# Altium schematic sheet Peripherals.SchDoc
size 420 x 297 mm; SheetNumber: 6; SheetTotal: 11; SPICEModelCacheINPTFRLM: <root> / <DocumentId>INPTFRLM</DocumentId> / <CacheFrame Number="0"> / <Model Name="0603_885012206095_100nf" Kind="CKT"> / <Text>******* / .subckt 0603_885012206095_100nF 1 2 / Rser 1 3 0.0157659152881 / Lser 2 4 3.10171966E-10 / C1 3 4 0.0000001 / Rpar 3 4 5000000000 / .ends 0603_885012206095_100nF</Text> / </Model> / <Model Name="0603_885012106006_10uf" Kind="CKT"> / <Text>******* / .subckt 0603_885012106006_10uF 1 2 / Rser 1 3 0.00407641026021 / Lser 2 4 4.16060333E-10 / C1 3 4 0.00001 / Rpar 3 4 5000000 / .ends 0603_885012106006_10uF</Text> / </Model> / </CacheFrame> / </root>
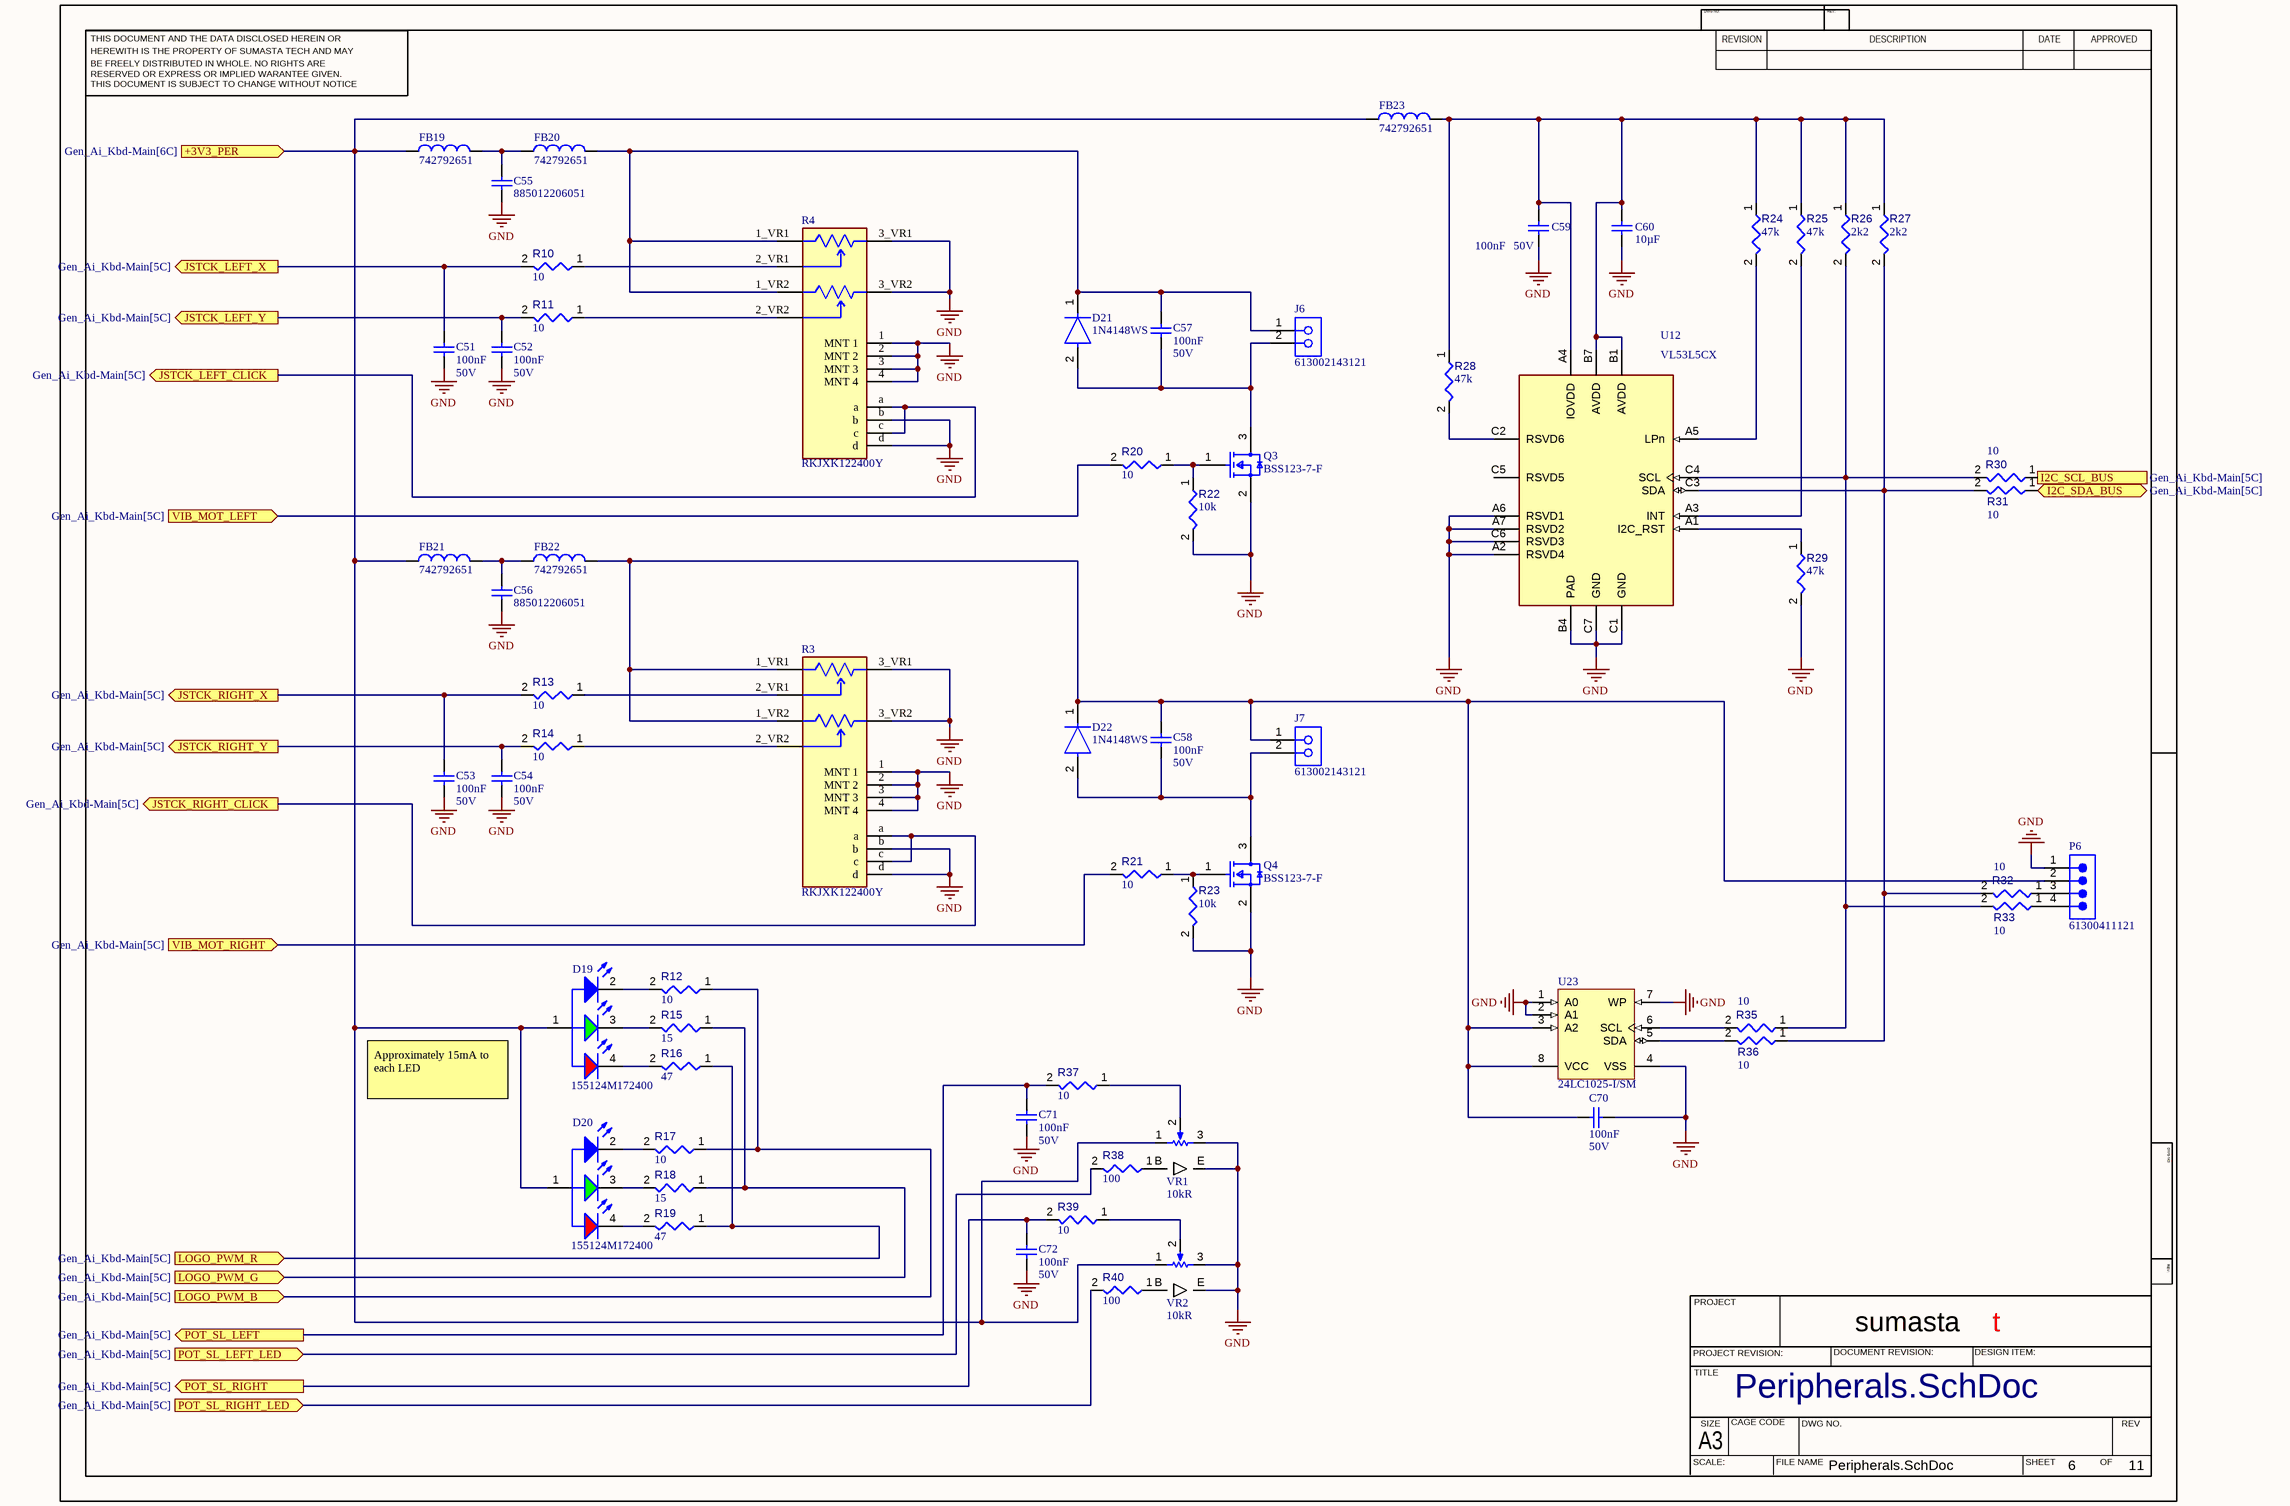
[diagram p0: Peripherals.SchDoc]

## Parts
C51  Capacitance: 100nF  Rated Voltage (DC): 50V  [WCAP-CSGP_0603_L1.6W0.8H0.8_Reflow]  (hidden comment: 885012206095)
C52  Capacitance: 100nF  Rated Voltage (DC): 50V  [WCAP-CSGP_0603_L1.6W0.8H0.8_Reflow]  (hidden comment: 885012206095)
C53  Capacitance: 100nF  Rated Voltage (DC): 50V  [WCAP-CSGP_0603_L1.6W0.8H0.8_Reflow]  (hidden comment: 885012206095)
C54  Capacitance: 100nF  Rated Voltage (DC): 50V  [WCAP-CSGP_0603_L1.6W0.8H0.8_Reflow]  (hidden comment: 885012206095)
C55  885012206051  [WCAP-CSGP_0603_L1.6W0.8H0.8_Reflow]
C56  885012206051  [WCAP-CSGP_0603_L1.6W0.8H0.8_Reflow]
C57  Capacitance: 100nF  Rated Voltage (DC): 50V  [WCAP-CSGP_0603_L1.6W0.8H0.8_Reflow]  (hidden comment: 885012206095)
C58  Capacitance: 100nF  Rated Voltage (DC): 50V  [WCAP-CSGP_0603_L1.6W0.8H0.8_Reflow]  (hidden comment: 885012206095)
C59  Capacitance: 100nF  Rated Voltage (DC): 50V  [WCAP-CSGP_0603_L1.6W0.8H0.8_Reflow]  (hidden comment: 885012206095)
C60  Capacitance: 10µF  [WCAP-CSGP_0603_L1.6W0.8H0.8_Reflow]  (hidden comment: 885012106006)
C70  Capacitance: 100nF  Rated Voltage (DC): 50V  [WCAP-CSGP_0603_L1.6W0.8H0.8_Reflow]  (hidden comment: 885012206095)
C71  Capacitance: 100nF  Rated Voltage (DC): 50V  [WCAP-CSGP_0603_L1.6W0.8H0.8_Reflow]  (hidden comment: 885012206095)
C72  Capacitance: 100nF  Rated Voltage (DC): 50V  [WCAP-CSGP_0603_L1.6W0.8H0.8_Reflow]  (hidden comment: 885012206095)
D19  155124M172400  [WL-SFSW_1204_155124M172400]
D20  155124M172400  [WL-SFSW_1204_155124M172400]
D21  1N4148WS  [FP-477AB-IPC_C]
D22  1N4148WS  [FP-477AB-IPC_C]
FB19  742792651  [WE-CBF_0603_L1.6W0.8H0.8_HC]
FB20  742792651  [WE-CBF_0603_L1.6W0.8H0.8_HC]
FB21  742792651  [WE-CBF_0603_L1.6W0.8H0.8_HC]
FB22  742792651  [WE-CBF_0603_L1.6W0.8H0.8_HC]
FB23  742792651  [WE-CBF_0603_L1.6W0.8H0.8_HC]
J6  613002143121  [613002143121]
J7  613002143121  [613002143121]
P6  61300411121  [61300411121]
Q3  BSS123-7-F  [FP-SOT23-MFG]
Q4  BSS123-7-F  [FP-SOT23-MFG]
R3  RKJXK122400Y  [FP-RKJXK122400Y-MFG]
R4  RKJXK122400Y  [FP-RKJXK122400Y-MFG]
R10  value 10  [RESC1608X55X25ML10T15]  (hidden comment: Resistor 10k +/-1% 0603 100 mW)
R11  value 10  [RESC1608X55X25ML10T15]  (hidden comment: Resistor 10k +/-1% 0603 100 mW)
R12  value 10  [RESC1608X55X25ML10T15]  (hidden comment: Resistor 10k +/-1% 0603 100 mW)
R13  value 10  [RESC1608X55X25ML10T15]  (hidden comment: Resistor 10k +/-1% 0603 100 mW)
R14  value 10  [RESC1608X55X25ML10T15]  (hidden comment: Resistor 10k +/-1% 0603 100 mW)
R15  value 15  [RESC1608X55X25ML10T15]  (hidden comment: Resistor 10k +/-1% 0603 100 mW)
R16  value 47  [RESC1608X55X25ML10T15]  (hidden comment: Resistor 10k +/-1% 0603 100 mW)
R17  value 10  [RESC1608X55X25ML10T15]  (hidden comment: Resistor 10k +/-1% 0603 100 mW)
R18  value 15  [RESC1608X55X25ML10T15]  (hidden comment: Resistor 10k +/-1% 0603 100 mW)
R19  value 47  [RESC1608X55X25ML10T15]  (hidden comment: Resistor 10k +/-1% 0603 100 mW)
R20  value 10  [RESC1608X55X25ML10T15]  (hidden comment: Resistor 10k +/-1% 0603 100 mW)
R21  value 10  [RESC1608X55X25ML10T15]  (hidden comment: Resistor 10k +/-1% 0603 100 mW)
R22  value 10k  [RESC1608X55X25ML10T15]  (hidden comment: Resistor 10k +/-1% 0603 100 mW)
R23  value 10k  [RESC1608X55X25ML10T15]  (hidden comment: Resistor 10k +/-1% 0603 100 mW)
R24  value 47k  [RESC1608X55X25ML10T15]  (hidden comment: Resistor 10k +/-1% 0603 100 mW)
R25  value 47k  [RESC1608X55X25ML10T15]  (hidden comment: Resistor 10k +/-1% 0603 100 mW)
R26  value 2k2  [RESC1608X55X25ML10T15]  (hidden comment: Resistor 10k +/-1% 0603 100 mW)
R27  value 2k2  [RESC1608X55X25ML10T15]  (hidden comment: Resistor 10k +/-1% 0603 100 mW)
R28  value 47k  [RESC1608X55X25ML10T15]  (hidden comment: Resistor 10k +/-1% 0603 100 mW)
R29  value 47k  [RESC1608X55X25ML10T15]  (hidden comment: Resistor 10k +/-1% 0603 100 mW)
R30  value 10  [RESC1608X55X25ML10T15]  (hidden comment: Resistor 10k +/-1% 0603 100 mW)
R31  value 10  [RESC1608X55X25ML10T15]  (hidden comment: Resistor 10k +/-1% 0603 100 mW)
R32  value 10  [RESC1608X55X25ML10T15]  (hidden comment: Resistor 10k +/-1% 0603 100 mW)
R33  value 10  [RESC1608X55X25ML10T15]  (hidden comment: Resistor 10k +/-1% 0603 100 mW)
R35  value 10  [RESC1608X55X25ML10T15]  (hidden comment: Resistor 10k +/-1% 0603 100 mW)
R36  value 10  [RESC1608X55X25ML10T15]  (hidden comment: Resistor 10k +/-1% 0603 100 mW)
R37  value 10  [RESC1608X55X25ML10T15]  (hidden comment: Resistor 10k +/-1% 0603 100 mW)
R38  value 100  [RESC1608X55X25ML10T15]  (hidden comment: Resistor 10k +/-1% 0603 100 mW)
R39  value 10  [RESC1608X55X25ML10T15]  (hidden comment: Resistor 10k +/-1% 0603 100 mW)
R40  value 100  [RESC1608X55X25ML10T15]  (hidden comment: Resistor 10k +/-1% 0603 100 mW)
U12  VL53L5CX  [VL53L5CX]
U23  24LC1025-I/SM  [SOIJ-SM8_L]
VR1  value 10kR  [PTL30-15R0]  (hidden comment: PTL30-15R0-103B1)
VR2  value 10kR  [PTL30-15R0]  (hidden comment: PTL30-15R0-103B1)

## Ports
+3V3_PER (in, see Gen_Ai_Kbd-Main[6C]), I2C_SCL_BUS (in, see Gen_Ai_Kbd-Main[5C]), I2C_SDA_BUS (bidir, see Gen_Ai_Kbd-Main[5C]), JSTCK_LEFT_CLICK (out, see Gen_Ai_Kbd-Main[5C]), JSTCK_LEFT_X (out, see Gen_Ai_Kbd-Main[5C]), JSTCK_LEFT_Y (out, see Gen_Ai_Kbd-Main[5C]), JSTCK_RIGHT_CLICK (out, see Gen_Ai_Kbd-Main[5C]), JSTCK_RIGHT_X (out, see Gen_Ai_Kbd-Main[5C]), JSTCK_RIGHT_Y (out, see Gen_Ai_Kbd-Main[5C]), LOGO_PWM_B (in, see Gen_Ai_Kbd-Main[5C]), LOGO_PWM_G (in, see Gen_Ai_Kbd-Main[5C]), LOGO_PWM_R (in, see Gen_Ai_Kbd-Main[5C]), POT_SL_LEFT (out, see Gen_Ai_Kbd-Main[5C]), POT_SL_LEFT_LED (in, see Gen_Ai_Kbd-Main[5C]), POT_SL_RIGHT (out, see Gen_Ai_Kbd-Main[5C]), POT_SL_RIGHT_LED (in, see Gen_Ai_Kbd-Main[5C]), VIB_MOT_LEFT (in, see Gen_Ai_Kbd-Main[5C]), VIB_MOT_RIGHT (in, see Gen_Ai_Kbd-Main[5C])

## Nets
GND: C51.2 C52.2 C53.2 C54.2 C55.1 C56.1 C59.1 C60.1 C70.1 C71.2 C72.2 P6.1 Q3.2(S) Q4.2(S) R3.1(MNT_1) R3.2(MNT_2) R3.3(MNT_3) R3.3_VR1(3_VR1) R3.3_VR2(3_VR2) R3.4(MNT_4) R3.b R3.d R4.1(MNT_1) R4.2(MNT_2) R4.3(MNT_3) R4.3_VR1(3_VR1) R4.3_VR2(3_VR2) R4.4(MNT_4) R4.b R4.d R22.2 R23.2 R29.2 U12.A2(RSVD4) U12.A6(RSVD1) U12.A7(RSVD2) U12.B4(PAD) U12.C1(GND) U12.C6(RSVD3) U12.C7(GND) U23.1(A0) U23.2(A1) U23.4(VSS) U23.7(WP) VR1.3(CCW) VR1.E(CCW) VR2.3(CCW) VR2.E(CCW)
+3V3_PER: D19.1(A) D20.1(A) FB19.1 FB21.1 FB23.1 VR1.1(CW) VR2.1(CW) ; port +3V3_PER
I2C_SCL_BUS: R30.1 ; port I2C_SCL_BUS
I2C_SDA_BUS: R31.1 ; port I2C_SDA_BUS
JSTCK_LEFT_CLICK: R4.a R4.c ; port JSTCK_LEFT_CLICK
JSTCK_LEFT_X: C51.1 R10.2 ; port JSTCK_LEFT_X
JSTCK_LEFT_Y: C52.1 R11.2 ; port JSTCK_LEFT_Y
JSTCK_RIGHT_CLICK: R3.a R3.c ; port JSTCK_RIGHT_CLICK
JSTCK_RIGHT_X: C53.1 R13.2 ; port JSTCK_RIGHT_X
JSTCK_RIGHT_Y: C54.1 R14.2 ; port JSTCK_RIGHT_Y
LOGO_PWM_B: R12.1 R17.1 ; port LOGO_PWM_B
LOGO_PWM_G: R15.1 R18.1 ; port LOGO_PWM_G
LOGO_PWM_R: R16.1 R19.1 ; port LOGO_PWM_R
POT_SL_LEFT: C71.1 R37.2 ; port POT_SL_LEFT
POT_SL_LEFT_LED: R38.2 ; port POT_SL_LEFT_LED
POT_SL_RIGHT: C72.1 R39.2 ; port POT_SL_RIGHT
POT_SL_RIGHT_LED: R40.2 ; port POT_SL_RIGHT_LED
VIB_MOT_LEFT: R20.2 ; port VIB_MOT_LEFT
VIB_MOT_RIGHT: R21.2 ; port VIB_MOT_RIGHT
NetC55_2: C55.2 FB19.2 FB20.1
NetC56_2: C56.2 FB21.2 FB22.1
NetC57_1: C57.1 D21.1(C) FB20.2 J6.1 R4.1_VR1(1_VR1) R4.1_VR2(1_VR2)
NetC57_2: C57.2 D21.2(A) J6.2 Q3.3(D)
NetC58_1: C58.1 C70.2 D22.1(C) FB22.2 J7.1 P6.2 R3.1_VR1(1_VR1) R3.1_VR2(1_VR2) U23.3(A2) U23.8(VCC)
NetC58_2: C58.2 D22.2(A) J7.2 Q4.3(D)
NetC59_2: C59.2 C60.2 FB23.2 R24.1 R25.1 R26.1 R27.1 R28.1 U12.A4(IOVDD) U12.B1(AVDD) U12.B7(AVDD)
NetD19_2: D19.2(K) R12.2
NetD19_3: D19.3(K) R15.2
NetD19_4: D19.4(K) R16.2
NetD20_2: D20.2(K) R17.2
NetD20_3: D20.3(K) R18.2
NetD20_4: D20.4(K) R19.2
NetP6_3: P6.3 R32.1
NetP6_4: P6.4 R33.1
NetQ3_1: Q3.1(G) R20.1 R22.1
NetQ4_1: Q4.1(G) R21.1 R23.1
NetR3_2_VR1: R3.2_VR1(2_VR1) R13.1
NetR3_2_VR2: R3.2_VR2(2_VR2) R14.1
NetR4_2_VR1: R4.2_VR1(2_VR1) R10.1
NetR4_2_VR2: R4.2_VR2(2_VR2) R11.1
NetR24_2: R24.2 U12.A5(LPn)
NetR25_2: R25.2 U12.A3(INT)
NetR26_2: R26.2 R30.2 R33.2 R35.1 U12.C4(SCL)
NetR27_2: R27.2 R31.2 R32.2 R36.1 U12.C3(SDA)
NetR28_2: R28.2 U12.C2(RSVD6)
NetR29_1: R29.1 U12.A1(I2C_RST)
NetR35_2: R35.2 U23.6(SCL)
NetR36_2: R36.2 U23.5(SDA)
NetR37_1: R37.1 VR1.2(S)
NetR38_1: R38.1 VR1.B(CCW)
NetR39_1: R39.1 VR2.2(S)
NetR40_1: R40.1 VR2.B(CCW)

Not connected (* = marked no-connect by the designer): U12 C5(RSVD5)

## Notes on the sheet
- Approximately 15mA to each LED
- THIS DOCUMENT AND THE DATA DISCLOSED HEREIN OR
- HEREWITH IS THE PROPERTY OF SUMASTA TECH AND MAY
- DWG NO:
- REVISION
- REV:
- DESCRIPTION
- DATE
- APPROVED
- BE FREELY DISTRIBUTED IN WHOLE. NO RIGHTS ARE
- THIS DOCUMENT IS SUBJECT TO CHANGE WITHOUT NOTICE
- RESERVED OR EXPRESS OR IMPLIED WARANTEE GIVEN.
- PROJECT
- sumasta
- t
- PROJECT REVISION:
- TITLE
- DOCUMENT REVISION:
- DESIGN ITEM:
- SCALE:
- A3
- SIZE
- CAGE CODE
- FILE NAME
- DWG NO.
- SHEET
- OF
- REV

## Library data of the parts
C51-C54 C57-C59 C70-C72 = CMP-007-000655-1: WCAP-CSGP Multilayer Ceramic Chip Capacitor, General Purpose, size 0603, X7R, 100nF, 50VDC; Manufacturer: Wurth Elektronik; Capacitance Tolerance: +/-10%; Insulation Resistance: 5GO; Case/Size Code: 0603; Technical Reference: X7R0603104K050DFCT10000; Dissipation Factor: 3%; Operating Temperature Max: 125°C; Category: Multilayer Ceramic Chip Capacitors; ComponentLink1Description: Website Link; Manufacturer Part Number: 885012206095; Pin Count: 2; Ceramic Type: X7R; Component Type: Standard; Mount: Surface Mount; Operating Temperature Min: -55°C; Source: WCAP-CSGP.SchLib; ComponentLink2URL: https://www.we-online.com/redexpert/spec/885012206095?ad; Packaging: Tape and Reel; Match Code: WCAP-CSGP; Width: 0.8mm; ComponentLink1URL: https://www.we-online.com/redexpert/article/885012206095?ad; Height: 0.8mm; Design Item ID: 885012206095; Length: 1.6mm; ComponentLink2Description: Datasheet Link
C55 C56 = CMP-03913-53914760-1: 885012206051 Cap Cer 0.68UF 16V X7R 0603; Insulation Resistance: 700MΩ; Tolerance: 10%; Capacitance: 680nF; NexarPartId: 53914760; Dielectric: X7R; Max Operating Temperature: 125°C; Thickness: 939.8µm; Case Code (Imperial): 0603; Length: 1.6mm; RoHS: Compliant; Min Operating Temperature: -55°C; Width: 800µm; Mount: Surface Mount; Height: 800µm; Case/Package: 0603; Case Code (Metric): 1608; Voltage Rating (DC): 16V; Packaging: Tape & Reel (TR); Voltage Rating: 16V
C60 = CMP-007-000403-1: WCAP-CSGP Multilayer Ceramic Chip Capacitor, General Purpose, size 0603, X5R, 10µF, 6.3VDC; Manufacturer: Wurth Elektronik; Rated Voltage (DC): 6.3V; Insulation Resistance: 0.01GO; Technical Reference: X5R0603106M6R3DFCT10000; Dissipation Factor: 10%; Case/Size Code: 0603; Capacitance Tolerance: +/-20%; Mount: Surface Mount; Packaging: Tape and Reel; ComponentLink1URL: https://www.we-online.com/redexpert/article/885012106006?ad; Height: 0.8mm; ComponentLink2URL: https://www.we-online.com/redexpert/spec/885012106006?ad; Category: Multilayer Ceramic Chip Capacitors; Operating Temperature Max: 85°C; Operating Temperature Min: -55°C; Source: WCAP-CSGP.SchLib; Match Code: WCAP-CSGP; Design Item ID: 885012106006; Ceramic Type: X5R; Manufacturer Part Number: 885012106006; Component Type: Standard; Pin Count: 2; Width: 0.8mm; ComponentLink2Description: Datasheet Link; ComponentLink1Description: Website Link; Length: 1.6mm
D19 D20 = CMP-03913-133884675-1: 155124M172400 Wl-sfsw SMT Full-color Side View; NexarPartId: 133884675
D21 D22 = CMP-07163-000040-1: DIODE GEN PURP 75V 150MA SOD323F; Forward Voltage: 1V; Power Dissipation: 200mW; Element Configuration: Single; Max Forward Surge Current (Ifsm): 2A; Peak Reverse Current: 5uA; Recovery Time: 4ns; Package Quantity: 1; Number of Pins: 2; Height: 1mm; REACH SVHC: No SVHC; Max Reverse Voltage (DC): 75V; Forward Current: 150mA; Length: 1.8mm; Max Repetitive Reverse Voltage (Vrrm): 75V; Max Operating Temperature: 150°C; Average Rectified Current: 150mA; Contact Plating: Tin; Packaging: Tape and Reel; Radiation Hardening: No; Min Operating Temperature: -55°C; Width: 1.35mm; Weight: 0.0276g; Lead Free: Lead Free; Mount: Surface Mount; Reverse Voltage: 75V; Reverse Recovery Time: 4ns
FB19-FB23 = CMP-0220-00181-3: NexarPartId: 7864500; RMS Current (Irms): 1A; Number of Lines: 1; Test Frequency: 100MHz; Impedance: 600Ω; Inductance: 360mH; Resistance: 200mΩ; Tolerance: 25%; Case Code (Imperial): 0603; Lead Free: Lead Free; Current Rating: 1A; Height: 800µm; Min Operating Temperature: -55°C; Core Material: Ferrite; REACH SVHC: Unknown; Case/Package: 0603; Weight: 3.997283mg; Mount: Surface Mount; Termination: SMD/SMT; Case Code (Metric): 1608; DC Resistance (DCR): 200mΩ; Series Resistance: 200mΩ; Max Operating Temperature: 125°C; Width: 800µm; Length: 1.6mm; Max DC Current: 1A; RoHS: Compliant; Material: Ferrite; Max Current Rating: 1A; Depth: 800µm; Packaging: Cut Tape (CT)
J6 J7 = CMP-1502-01405-2: NexarPartId: 61924709; Gender: Female; Current Rating: 3A; Contact Resistance: 20mΩ; Operating Supply Voltage: 250V; RoHS: Non-Compliant; Number of Pins: 2; Lead Pitch: 2.54mm
P6 = CMP-1502-01064-2: NexarPartId: 32855522; Pitch: 2.54mm; Number of Contacts: 4; Contact Resistance: 20mΩ; Gender: Male; Current Rating: 3A; Connector Type: Male Pin; Voltage Rating: 250V; Lead Free: Lead Free; Contact Plating: Gold; Max Operating Temperature: 105°C; Packaging: Bulk; Height: 8.89mm; Orientation: Vertical; Contact Mating Length: 5.9944mm; Contact Material: Copper; Lead Pitch: 2.54mm; Min Operating Temperature: -40°C; Termination: Solder; Color: Black; Number of Rows: 1; REACH SVHC: Unknown; RoHS: Compliant; Mount: Through Hole; Number of Positions: 4; Number of Pins: 4; Operating Supply Voltage: 250V
Q3 Q4 = CMP-12801-000017-1: MOSFET N-CH 100V 170MA SOT23-3; Manufacturer: Diodes Incorporated; Standoff Height: 0.013mm; Power Dissipation: 300mW; Gate To Source Voltage: 20V; Transconductance: 0.37S; Pulse Drain Current: 680mA; Max Forward Diode Voltage: 1.3V; Input Capacitace At Vds: 22pF @ 25V; Number Of N Channels: 1; Threshold Vgs Min: 0.8V; Threshold Vgs Max: 2V; Turn On Delay Time: 8ns; Depletion Mode: False; Typ Forward Diode Voltage: 0.84V; Drain To Source Resistance: 6Ω; Max Junction Temp: +150°C; Rthja Max: 417°C/W; Turn Off Delay Time: 13ns; Automotive Grade: NA; Lead Free: Yes; Manufacturer Part Number: BSS123-7-F; Device Class L1: Discrete Semiconductors; Footprint Url: https://www.diodes.com/assets/Package-Files/SOT23.pdf; Automotive: No; ComponentLink2Description: Datasheet; Octopart: https://octopart.com/bss123-7-f-diodes+inc.-335886; Mouser Description: MOSFET 100V 360mW; RoHS: TRUE; Temperature Range Low: -55°C; Number Of Channels: 1; Device Class L3: MOSFETs; Temperature Range High: +150°C; Drain To Source Breakdown Voltage: 100V; Package: SOT23; Temperature: -55°C to +150°C; Continuous Drain Current: 170mA; Category: Trans; Drain To Source Voltage: 100V; ComponentLink2URL: https://www.diodes.com/assets/Datasheets/ds30366.pdf; Height: 1.1mm; Digikey Description: MOSFET N-CH 100V 170MA SOT23-3; Device Class L2: Transistors
R3 R4 = CMP-24118-000005-1: Res POT 10K Ohm 0.0125W (25.4 X 20.7 X 19.3mm) Pin Bracket Mount/Through Hole Tray; Insulation Resistance: 100MR; Resistance: 10kR; Power Rating: 12.5mW; Current Rating: 50mA; Life (Hours): 100Hour; Type: Potentiometer; Mount: Through Hole; Series: RKJXV/ RKJXK; Packaging: Tray; Radiation Hardening: No; Resistor Type: Potentiometer; Termination: Pin; Height: 12.9mm; Military Standard: Not; Min Operating Temperature: -10°C; Max Operating Temperature: 70°C; Package Quantity: 1000; Contact Current Rating: 50mA; Width: 16mm; Depth: 20.7mm; Length: 16mm; RoHS Compliant: Yes
R10-R33 R35-R40 = CMP-009-00017-5: Chip Resistor, 10 KOhm, +/- 1%, 01 W, -55 to 155 degC, 0603 (1608 Metric); Voltage Rating: 50V; Power: 100mW; RoHS Compliant: True; Min Operating Temperature: -55°C; Pins: 2; Case/Package: 0603; Mounting Technology: SM; Max Operating Temperature: 155°C; Tolerance: 1%
U12 = CMP-003-000011-1: VL53L5CX - 8X8 Segment, Light, 3D Time-of-Flight _ToF_ Sensor Evaluation Board
U23 = CMP-0159-00567-1: 1 Mbit, 400kHz, 2.5V, I2C Serial EEPROM, 8-Pin SOIC 208mil, Industrial Temperature; PackageDescription: 8-Lead Plastic Small Outline (SM) - Medium, 5.28 mm Body [SOIJ]; PackageReference: SOIJ-SM8; DatasheetVersion: revF, Oct-2008; PackageVersion: revBB, Aug-2009
VR1 VR2 = CMP-009-00177-1: Linear Trimpot(R) Trimming Potentiometer, 10 KOhm, +/- 10%, 0.5 W, -55 to 125 degC, 3-Pin THD, RoHS, Tube; Manufacturer: Bourns; Resistance: 10k; Tolerance: 20%; Voltage Rating: 300V; Power: 500mW; Packaging: Bulk; RoHS Compliant: Yes; Package Reference: 3296W; Package Description: 3-Pin Through Hole Device, Body 9.53 x 4.83 mm, Pitch 2.54 mm; Max Operating Temperature: 55°C; Case/Package: 3296W; Package Quantity: 600; Manufacturer URL: http://www.bourns.com/; Mounting Technology: Through Hole; Datasheet URL: http://www.bourns.com/docs/Product-Datasheets/3296.pdf; Datasheet Version: May-16; Min Operating Temperature: -10°C